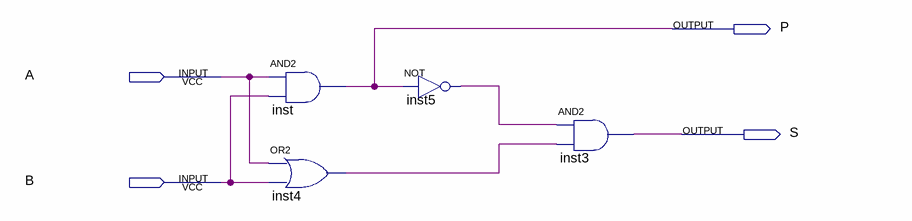
[diagram p0: schematic sheet]
// Quartus schematic HS_nda1_3.bdf as structural Verilog: 4 symbols, 4 pins
module HS_nda1_3 (
  input  A,
  input  B,
  output P,
  output S
);

  wire inst4_out, inst5_out;

  and inst (P, A, B);
  or inst4 (inst4_out, A, B);
  not inst5 (inst5_out, P);
  and inst3 (S, inst5_out, inst4_out);
endmodule
